# Altium project RADIO_DEMO.PrjPcb
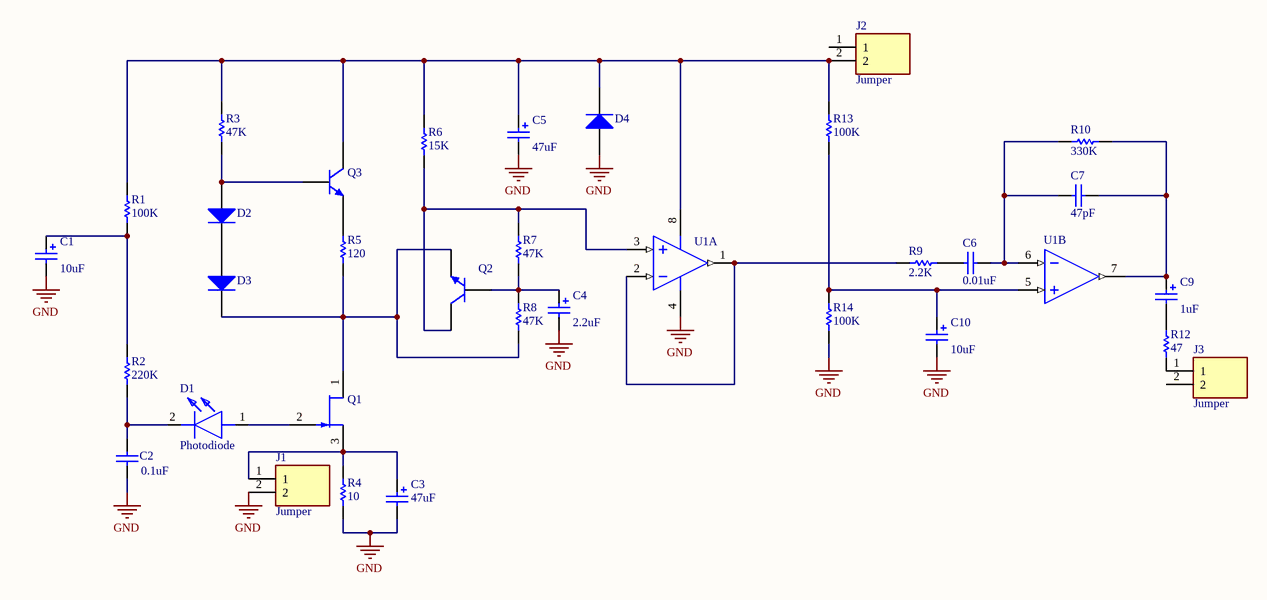
[diagram p0: Project.SchDoc]
1 sheet, 33 parts. Net scope: global (net labels, ports and power ports of the same name join across sheets).
Board file: DEMO.PcbDoc

## Sheet Project.SchDoc
size A4; SheetNumber: 1; SheetTotal: 1

### Parts
C1  value 10uF  [Capacitor - Pol]  (hidden comment: Cap Pol1)
C2  value 0.1uF  [Capacitor]  (hidden comment: Cap)
C3  value 47uF  [Capacitor - Pol]  (hidden comment: Cap Pol1)
C4  value 2.2uF  [Capacitor - Pol]  (hidden comment: Cap Pol1)
C5  value 47uF  [Capacitor - Pol]  (hidden comment: Cap Pol1)
C6  value 0.01uF  [Capacitor]  (hidden comment: Cap)
C7  value 47pF  [Capacitor]  (hidden comment: Cap)
C9  value 1uF  [Capacitor - Pol]  (hidden comment: Cap Pol1)
C10  value 10uF  [Capacitor - Pol]  (hidden comment: Cap Pol1)
D1  Photodiode  [Diode]
D2  Diode 1N5408  [Diode]  (value not drawn)
D3  Diode 1N5408  [Diode]  (value not drawn)
D4  Diode 1N5408  [Diode]  (value not drawn)
J1  Jumper  [JUMPER]
J2  Jumper  [JUMPER]
J3  Jumper  [JUMPER]
Q1  JFET-N  [TRANSISTOR]  (value not drawn)
Q2  NPN  [TRANSISTOR]  (value not drawn)
Q3  NPN  [TRANSISTOR]  (value not drawn)
R1  value 100K  [RES - Axial 0.6]  (hidden comment: Res1)
R2  value 220K  [RES - Axial 0.6]  (hidden comment: Res1)
R3  value 47K  [RES - Axial 0.6]  (hidden comment: Res1)
R4  value 10  [RES - Axial 0.6]  (hidden comment: Res1)
R5  value 120  [RES - Axial 0.6]  (hidden comment: Res1)
R6  value 15K  [RES - Axial 0.6]  (hidden comment: Res1)
R7  value 47K  [RES - Axial 0.6]  (hidden comment: Res1)
R8  value 47K  [RES - Axial 0.6]  (hidden comment: Res1)
R9  value 2.2K  [RES - Axial 0.6]  (hidden comment: Res1)
R10  value 330K  [RES - Axial 0.6]  (hidden comment: Res1)
R12  value 47  [RES - Axial 0.6]  (hidden comment: Res1)
R13  value 100K  [RES - Axial 0.6]  (hidden comment: Res1)
R14  value 100K  [RES - Axial 0.6]  (hidden comment: Res1)
U1  LM833N/NOPB  [DIP8]  (value not drawn)  (parts A,B of 2)

### Nets
GND: C1.2 C2.1 C3.2 C4.2 C5.2 C10.2 D4.1(A) J1.2 R4.1 R14.1 U1.4(V-)
NetC1_1: C1.1 R1.1 R2.2
NetC2_2: C2.2 D1.2(K) R2.1
NetC3_1: C3.1 J1.1 Q1.3(S) R4.2
NetC4_1: C4.1 Q2.2(B) R7.1 R8.2
NetC5_1: C5.1 D4.2(K) J2.2 Q3.1(C) R1.2 R3.2 R6.2 R13.2 U1.8(TAB)
NetC6_1: C6.1 C7.2 R10.2 U1.6(OUT)
NetC6_2: C6.2 R9.1
NetC7_1: C7.1 C9.1 R10.1 U1.7(V+)
NetC9_2: C9.2 R12.2
NetC10_1: C10.1 R13.1 R14.2 U1.5(OS_NUL)
NetD1_1: D1.1(A) Q1.2(G)
NetD2_1: D2.1(A) Q3.2(B) R3.1
NetD2_2: D2.2(K) D3.1(A)
NetD3_2: D3.2(K) Q1.1(D) Q2.3(E) R5.1 R8.1
NetJ3_1: J3.1 R12.1
NetQ2_1: Q2.1(C) R6.1 R7.2 U1.3(IN+)
NetQ3_3: Q3.3(E) R5.2
NetR9_2: R9.2 U1.1(OS_NUL) U1.2(IN-)

Not connected (* = marked no-connect by the designer): J2 1; J3 2

### Library data of the parts
C1 C3-C5 C9 C10 = Cap Pol1: Polarized Capacitor (Radial); Published: 8-Jun-2000; LatestRevisionDate: 17-Jul-2002; LatestRevisionNote: Re-released for DXP Platform.; PackageReference: RB7.6-15; Publisher: Altium Limited; PackageDescription: Polarized Capacitor (Radial); 2 Leads
C2 C6 C7 = Cap: Capacitor; Published: 8-Jun-2000; LatestRevisionDate: 17-Jul-2002; LatestRevisionNote: Re-released for DXP Platform.; PackageReference: RAD-0.3; Publisher: Altium Limited; PackageDescription: Radial Cap, Thru-Hole; 2 Leads; 0.3 in Pin Spacing
D2-D4 = Diode 1N5408: 3 Amp Medium Power Silicon Rectifier Diode; Published: 8-Jun-2000; LatestRevisionDate: 17-Jul-2002; LatestRevisionNote: Re-released for DXP Platform.; DatasheetVersion: Aug-1984; PackageReference: DO-201AD; Publisher: Altium Limited; PackageDescription: Diode, Axial; Body 9.5 x 5.3 mm (LxDia. max), Lead Dia. 1.32 mm (max); ComponentLink1Description: Manufacturer Link; ComponentLink1URL: http://www.irf.com/
Q1 = JFET-N: N-Channel JFET; Published: 8-Jun-2000; LatestRevisionDate: 17-Jul-2002; LatestRevisionNote: Re-released for DXP Platform.; PackageReference: TO-254-AA; Publisher: Altium Limited; Code_JEDEC: TO-254-AA
Q2 Q3 = NPN: NPN Bipolar Transistor; Published: 8-Jun-2000; LatestRevisionDate: 17-Jul-2002; LatestRevisionNote: Re-released for DXP Platform.; PackageReference: TO-226-AA; Publisher: Altium Limited; PackageDescription: TO, Flat Index; 3 In-Line, Axial Leads; Body Dia. 4.8mm; Leads 0.55 x 0.51 mm (max); Code_JEDEC: TO-226-AA
R1-R10 R12-R14 = Res1: Resistor; Published: 8-Jun-2000; LatestRevisionDate: 17-Jul-2002; LatestRevisionNote: Re-released for DXP Platform.; PackageReference: AXIAL-0.3; Publisher: Altium Limited; PackageDescription: Axial Device, Thru-Hole; 2 Leads; 0.3 in Pin Spacing
U1 = LM833N/NOPB: AUDIO AMPLIFIER; Manufacturer: TI National Semiconductor; Max Dual Supply Voltage: 18V; Voltage Gain: 110dB; Common Mode Rejection Ratio: 80dB; Number of Channels: 2; Min Dual Supply Voltage: 5V; Slew Rate: 7V/µs; Nominal Supply Current: 5mA; Unity Gain Bandwidth Product: 15MHz; Input Bias Current: 1uA; Input Offset Voltage (Vos): 5mV; Power Dissipation: 500mW; Output Current: 40mA; Load Impedance: 2kR; Dual Supply Voltage: 9V; Supplier 1: Mouser; Manufacturer Part Number: LM833N/NOPB; RoHS: Yes; Category: Amplifiers - Op Amps, Buffer, Instrumentation; Stock 1: 2883; Pricing 1: 1=0.88000, 10=0.79200, 50=0.79200, 100=0.57600, 1000=0.37500, 10000=0.37500 (USD); Mount: Through Hole; Case/Package: PDIP; Number of Pins: 8; Weight: 0.01lb; Min Operating Temperature: -40°C; Max Operating Temperature: 85°C; Package Quantity: 40; Packaging: Rail/Tube; Operating Supply Voltage: 18V; Number of Circuits: 2; Gain Bandwidth Product: 15MHz; Operating Supply Current: 5mA; Number of Elements: 2; Power Supply Rejection Ratio (PSRR): 80dB; Series: -; Supply Current: 5mA; Technology: BIPOLAR; Length: 9.27mm; Width: 6.35mm; Height: 3.3mm; Radiation Hardening: No; REACH SVHC: No SVHC; Lead Free: Lead Free; RoHS Compliant: Yes; ComponentLink1URL: https://datasheet.ciiva.com/2973/lm833-n-2973456.pdf?src-supplier=Avnet; ComponentLink1Description: https://datasheet.ciiva.com/2973/lm833-n-2973456.pdf?src-supplier=Avnet; ComponentLink2URL: https://datasheet.ciiva.com/4755/lm833-n-220371-4755091.pdf?src-supplier=Mouser; ComponentLink2Description: https://datasheet.ciiva.com/4755/lm833-n-220371-4755091.pdf?src-supplier=Mouser; ComponentLink3URL: https://datasheet.ciiva.com/1482/1814449-1482436.pdf?src-supplier=Element14; ComponentLink3Description: https://datasheet.ciiva.com/1482/1814449-1482436.pdf?src-supplier=Element14; ComponentLink4URL: https://datasheet.ciiva.com/14153/mnlm833-e-14153231.pdf?src-supplier=Distrelec; ComponentLink4Description: https://datasheet.ciiva.com/14153/mnlm833-e-14153231.pdf?src-supplier=Distrelec; ComponentLink5URL: https://datasheet.ciiva.com/6630/lm833-n-6630645.pdf?src-supplier=Digi-Key; ComponentLink5Description: https://datasheet.ciiva.com/6630/lm833-n-6630645.pdf?src-supplier=Digi-Key; Supplier Part Number 1: 926-LM833N/NOPB